# Altium schematic sheet Sensor.SchDoc
size A4
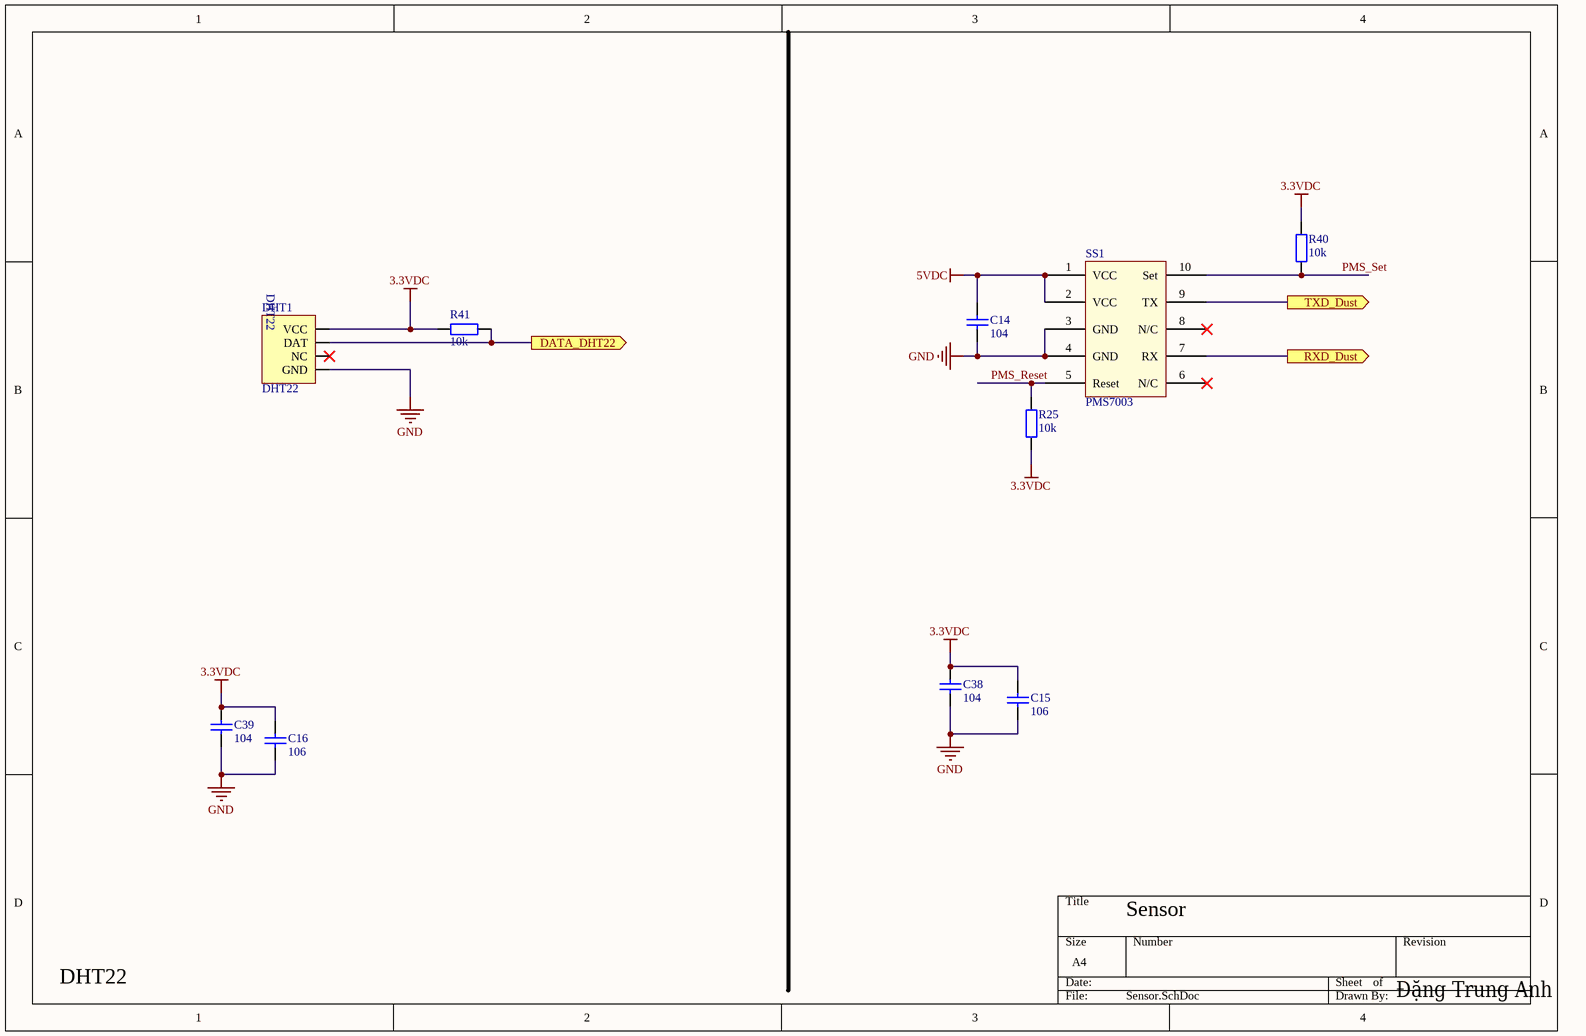
[diagram p0: Sensor.SchDoc]

## Parts
C14  104  [tu 0805]
C15  106  [Tu 0805]
C16  106  [Tu 0805]
C38  104  [Tu 0805]
C39  104  [Tu 0805]
DHT1  DHT22  [DHT22]
R25  10k  [tro smd 0805]
R40  10k  [tro smd 0805]
R41  10k  [tro smd 0805]
SS1  PMS7003  [PMS7003]

## Ports
DATA_DHT22 (out), RXD_Dust (out), TXD_Dust (out)

## Nets
3.3VDC: C15.2 C16.2 C38.2 C39.2 DHT1.1(VCC) R25.1 R40.1 R41.1
5VDC: C14.1 SS1.1(VCC) SS1.2(VCC)
GND: C14.2 C15.1 C16.1 C38.1 C39.1 DHT1.4(GND) SS1.3(GND) SS1.4(GND)
DATA_DHT22: DHT1.2(DAT) R41.2 ; port DATA_DHT22
PMS_Reset: R25.2 SS1.5(Reset)
PMS_Set: R40.2 SS1.10(Set)
RXD_Dust: SS1.7(RX) ; port RXD_Dust
TXD_Dust: SS1.9(TX) ; port TXD_Dust

Not connected (* = marked no-connect by the designer): DHT1 3(NC)*; SS1 6(N/C)* 8(N/C)*

## Notes on the sheet
- Sensor
- DHT22
- Đặng Trung Anh

## Library data of the parts
C14 = Tu 0805 104 50V 10%: Dán; Don_Vi: Con; So_Chan: 2; Ten_Linh_Kien: Tụ 0805 104-100nF 10% 50V; Ma_Hang: MH004551; Chung_Loai: Dán; Kieu_Chan: *
C15 C16 = Tu 0805 106 16V 10%: Dán; Ten_Linh_Kien: Tụ 0805 106-10uF 10% 16V; So_Chan: 2; Don_Vi: Con; Ma_Hang: MH004553; Chung_Loai: Dán; Kieu_Chan: *
C38 C39 = Tu 104: Dán; Ten_Linh_Kien: Tụ 0805 104-100nF 10% 50V; Don_Vi: Con; Ma_Hang: MH004551; Kieu_Chan: *; Chung_Loai: Dán; Ghi_Chu: *
DHT1 = DHT22: Manufacturer: W¨¹rth Elektronik eiSos GmbH; partNo: 613004143121; ComponentLink1 Description: Manufacturer; ComponentLink2 Description: Datasheet; NoPins: 04; Created Date: 29 March 2013; ComponentLink1URL: http://www.we-online.com; ComponentLink2URL: http://katalog.we-online.de/em/datasheet/6130xx143121.pdf; Created by: Karrer Zheng
R25 R40 R41 = Tro 0805 5% 10k: Dán; Don_Vi: Con; So_Chan: 2; Ten_Linh_Kien: Trở 0805 5% 10k; Ma_Hang: MH005239; Chung_Loai: Dán; Kieu_Chan: *